# EAGLE design magnilamp_led_driver (EAGLE 9.6.2)
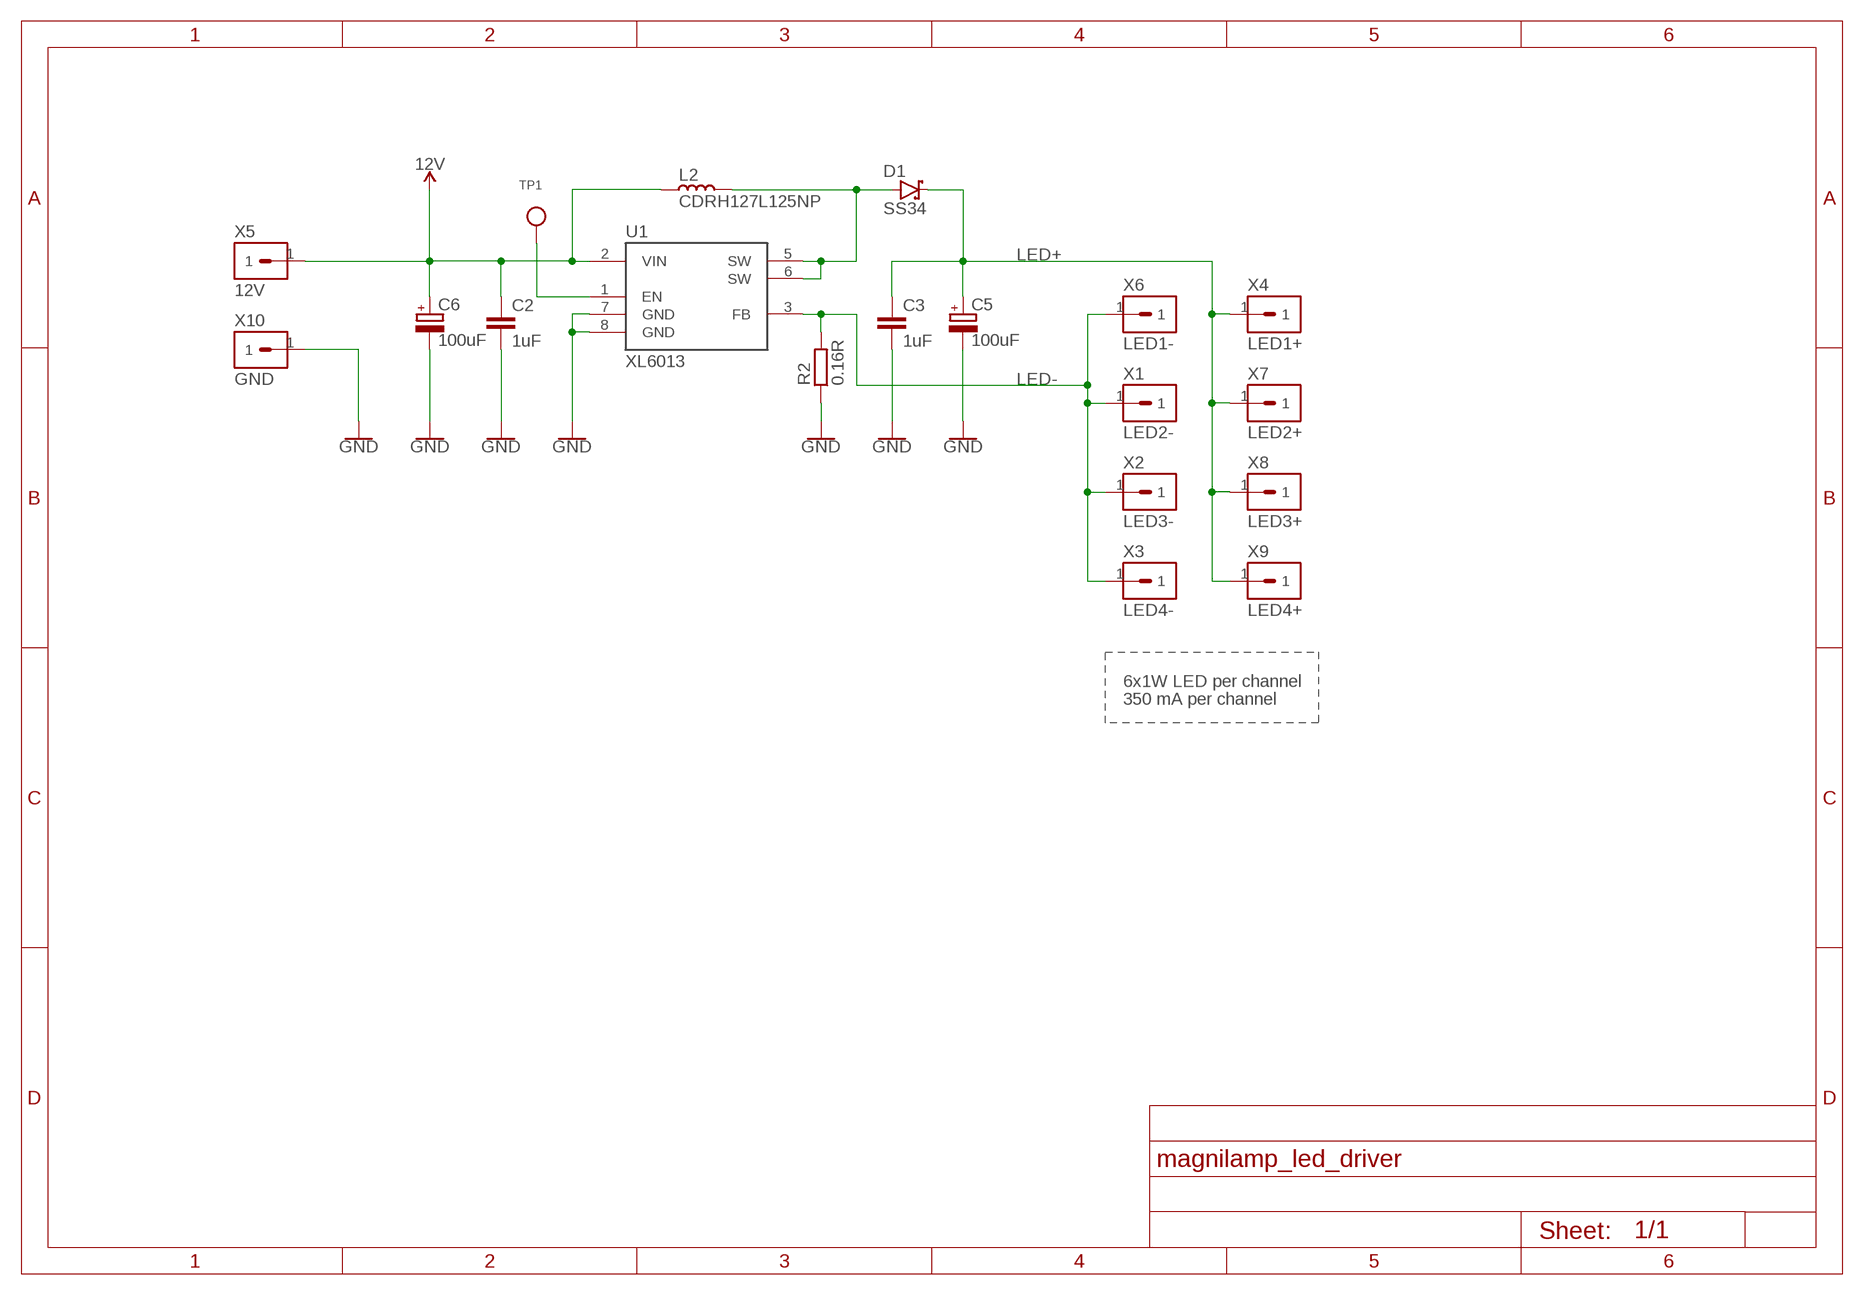
[diagram p0: schematic, sheet 1]

## Parts
C2  1uF  CAPC0603  [C0603]
C3  1uF  CAPC0603  [C0603]
C5  100uF  CAP-KEMETKN  [KEMET-KN]
C6  100uF  CAP-KEMETKN  [KEMET-KN]
D1  SS34  DIODE-SCHOTTKYDO-214AC  [DO-214AC]
L2  CDRH127L125NP  IND-SUMIDACDRH127L125  [SUMIDA-CDRH127L125]
R2  0.16R  RESISTOR1206  [R1206]
TP1  TESTPOINTPAD  [TESTPOINT_PAD_2MM]
U1  XL6013  XLSEMI-XL6013  [SOP8]
X1  LED2-  SOLDERPAD4X5  [SOLDERPAD-4X5]
X2  LED3-  SOLDERPAD4X5  [SOLDERPAD-4X5]
X3  LED4-  SOLDERPAD4X5  [SOLDERPAD-4X5]
X4  LED1+  SOLDERPAD4X5  [SOLDERPAD-4X5]
X5  12V  SOLDERPAD4X5  [SOLDERPAD-4X5]
X6  LED1-  SOLDERPAD4X5  [SOLDERPAD-4X5]
X7  LED2+  SOLDERPAD4X5  [SOLDERPAD-4X5]
X8  LED3+  SOLDERPAD4X5  [SOLDERPAD-4X5]
X9  LED4+  SOLDERPAD4X5  [SOLDERPAD-4X5]
X10  GND  SOLDERPAD4X5  [SOLDERPAD-4X5]

## Nets
12V: C2.1 C6.+ L2.1 U1.2(VIN) X5.1
GND: C2.2 C3.2 C5.- C6.- R2.1 U1.7(GND) U1.8(GND) X10.1
LED+: C3.1 C5.+ D1.C X4.1 X7.1 X8.1 X9.1
LED-: R2.2 U1.3(FB) X1.1 X2.1 X3.1 X6.1
N$1: TP1.P$1 U1.1(EN)
N$2: D1.A L2.2 U1.5(SW) U1.6(SW)

## Notes on the sheet
- 6x1W LED per channel
- 350 mA per channel

## Library data of the parts
C2 C3 = M2M-Passives:CAP
C5 C6 = M2M-Passives:CAP-KEMET
D1 = M2M-DiscreteSemi:DIODE-SCHOTTKY: 304020028
L2 = M2M-Passives:IND-SUMIDA
R2 = M2M-Passives:RESISTOR
TP1 = M2M-TestPoints:TESTPOINT: Test Point Various test points for characterisation and PCB testing TESTPOINT_SMT - Compact Surface Mount Test Point [Digikey: 5016KTR-ND]
U1 = M2M-IC:XLSEMI-XL6013
X1-X10 = M2M-Connectors:SOLDERPAD

## Board
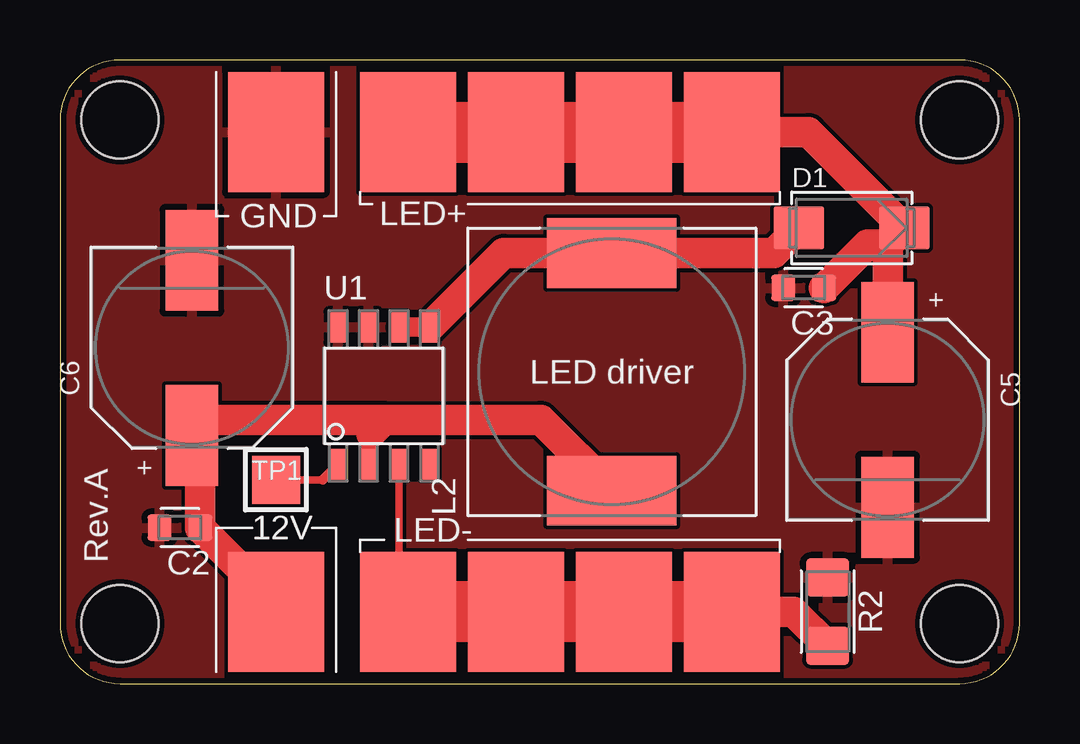
[diagram p1: board, top side]

Size 40 x 26 mm. Coordinates in mm from the lower left corner, seen from the top.
Outline: 0,23.5 0,2.5 arc90 2.5,0 37.5,0 arc90 40,2.5 40,23.5 arc90 37.5,26 2.5,26 arc90 0,23.5
Copper layers (1*16): Top 0.035mm / dielectric 1.5mm / Bottom 0.035mm
Design rules "SeeedStudio_2layer_DRU_no_angle_20140221": minimum track width 6mil, minimum drill 0.3mm, track to track 6mil, track to pad 6mil, pad to pad 6mil, via to via 6mil, smd to smd 0mil, copper to edge 10mil, drill to drill 10mil, minimum pad ring 2mil, minimum via ring 6mil, stop-mask expansion 2mil, vias tented up to drill 1000mil, thermal gap 10mil
Holes 3.2 mm at 2.5,23.5 37.5,23.5 37.5,2.5 2.5,2.5

### Footprints (pad centres in the part's own frame; a part is rotated, then mirrored left to right if it is on the bottom)
C0603 = smd 1 x 1.1: 1 -0.85,0; 2 0.85,0
KEMET-KN = smd 4.2 x 2.2: + -3.65,0; - 3.65,0
DO-214AC = smd 2.1 x 1.8: A -2.2,0; C 2.2,0
SUMIDA-CDRH127L125 = smd 2.9 x 5.4: 1 -4.95,0; 2 4.95,0
R1206 = smd 1.6 x 1.803: 1 -1.422,0; 2 1.422,0
TESTPOINT_PAD_2MM = smd 2 x 2: P$1 0,0
SOP8 = smd 0.72 x 1.27: 1 -1.905,-2.86; 2 -0.635,-2.86; 3 0.635,-2.86; 4 1.905,-2.86; 5 1.905,2.86; 6 0.635,2.86; 7 -0.635,2.86; 8 -1.905,2.86
SOLDERPAD-4X5 = smd 4 x 5: 1 0,0

### Placement (x,y rotation side)
C2  5,6.5 180 top
C3  31,16.5 180 top
C5  34.5,11 270 top
C6  5.5,14 90 top
D1  33,19 0 top
L2  23,13 90 top
R2  32,3 270 top
TP1  9,8.5 0 top
U1  13.5,12 0 top
X1  23.5,3 0 top
X2  19,3 0 top
X3  14.5,3 0 top
X4  28,23 0 top
X5  9,3 180 top
X6  28,3 0 top
X7  23.5,23 0 top
X8  19,23 0 top
X9  14.5,23 0 top
X10  9,23 0 top

### Tracks (layer width: path | path; a pad name or v marks a point on that pad's centre or on a via)
12V
  Top 0.813: U1.2 12.87,10.37
  Top 1.016: 12.87,10.37 13,10.5
  Top 1.27: 13,10.5 13.5,11 | L2.1 20.05,11 13.5,11 | 13.5,11 6.15,11 C6.+ 5.85,10 C2.1 9,3.35 X5.1
GND
  pour Top: -0.5,26.5 40.5,26.5 40.5,-0.5 -0.5,-0.5
LED+
  Top 1.27: 34.5,18.3 D1.C 31.2,23 X4.1 | 34.5,18.3 C5.+ | C3.1 33.65,18.3 34.5,18.3
  Top 2.54: X9.1 X8.1 X7.1 X4.1
LED-
  Top 0.305: U1.3 14.13,3.37 X3.1
  Top 1.27: X6.1 30.58,3 R2.2
  Top 2.54: X6.1 X1.1 X2.1 X3.1
N$1
  Top 0.305: 10.96,8.5 TP1.P$1
  Top 0.406: U1.1 10.96,8.5
N$2
  Top 0.813: U1.6 U1.5
  Top 1.27: U1.5 18.5,17.95 L2.2 29.75,17.95 D1.A

### Text on the board
tPlace: GND | LED+ | LED driver | Rev.A | 12V | LED-